# Altium schematic sheet STM32-ROMI_Rev_A_2_Connectors.SchDoc
size A4; Organization: Altium Limited; Address1: L3, 12a Rodborough Rd; Address2: Frenchs Forest; Address3: NSW; Address4: Australia 2086
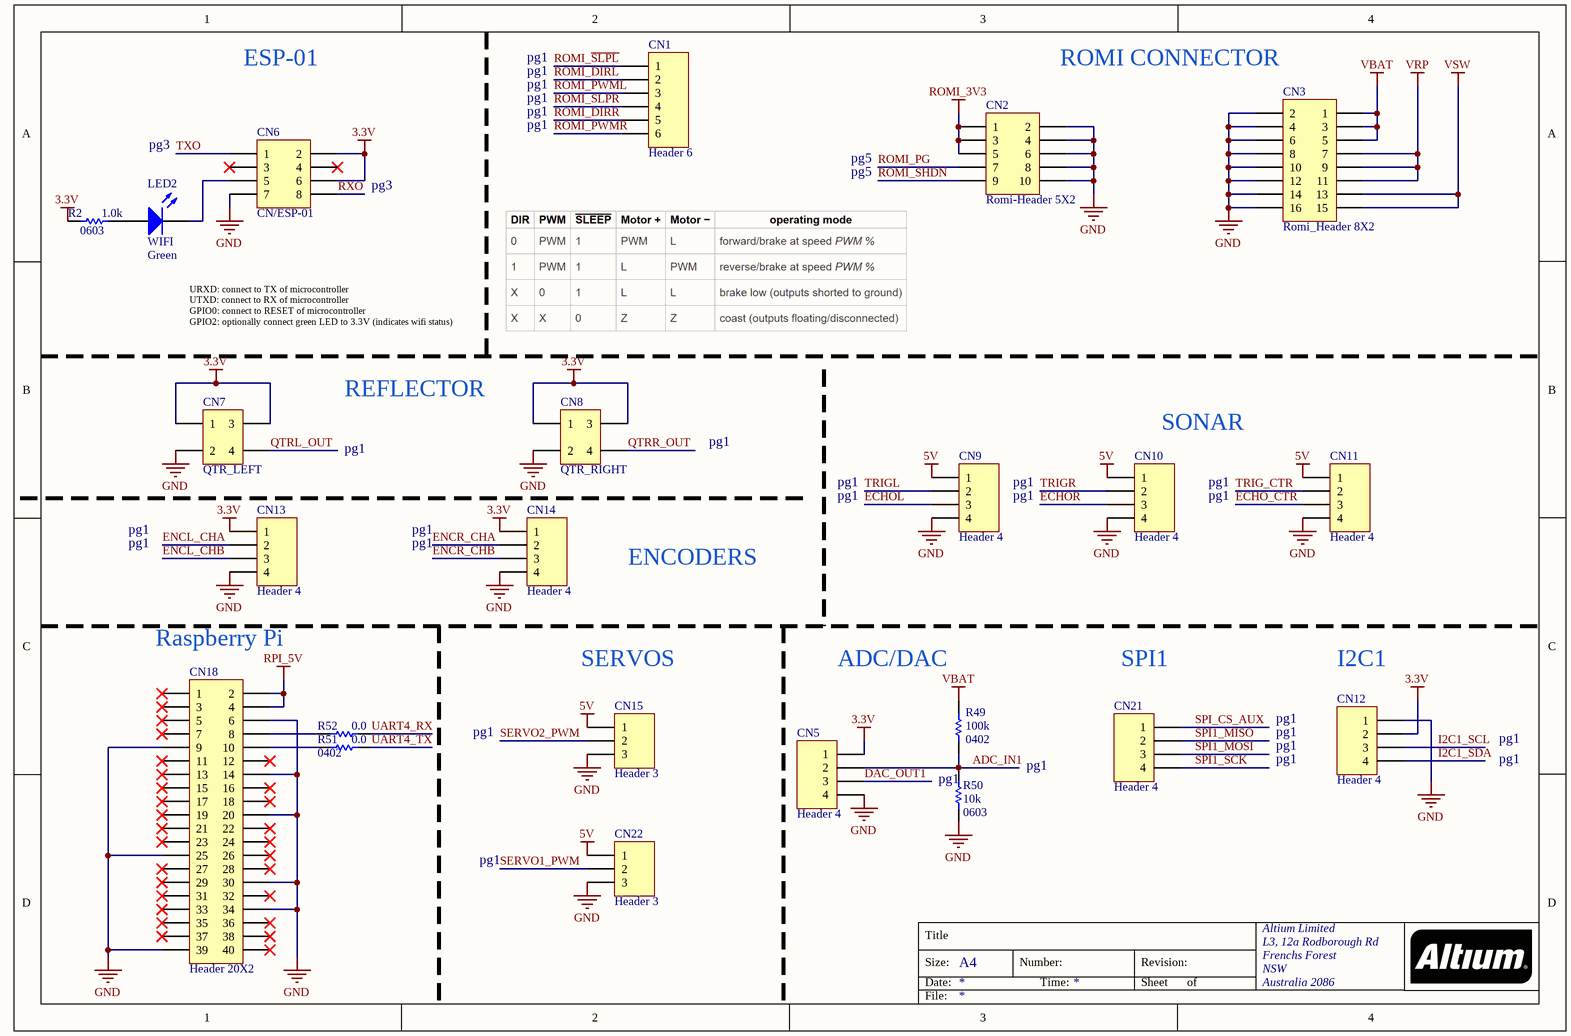
[diagram p0: STM32-ROMI_Rev_A_2_Connectors.SchDoc]

## Parts
CN1  Header 6  [PinHeader_1x06_P2.54mm_Vertical]
CN2  Romi-Header 5X2  [PinHeader_2x05_P2.54mm_Vertical - duplicate]
CN3  Romi_Header 8X2  [PinHeader_2x08_P2.54mm_Vertical]
CN5  Header 4  [HDR1X4]
CN6  CN/ESP-01  [ESP-01]
CN7  QTR_LEFT  [Molex 2x2 Microfit]
CN8  QTR_RIGHT  [Molex 2x2 Microfit]
CN9  Header 4  [HDR1X4]
CN10  Header 4  [HDR1X4]
CN11  Header 4  [HDR1X4]
CN12  Header 4  [HDR1X4]
CN13  Header 4  [HDR1X4]
CN14  Header 4  [HDR1X4]
CN15  Header 3  [HDR1X3]
CN18  Header 20X2  [Raspberry_Pi_2_3]
CN21  Header 4  [HDR1X4]
CN22  Header 3  [HDR1X3]
LED2  WIFI  Color: Green  [SM-LED-0603]
R2  Package / Case: 0603  [RESC0603(1608)_N]  (hidden comment: 1.0K)
R49  Supplier Device Package: 0402  Resistance (Ohms): 100k  [RESC0402(1005)_L]  (hidden comment: 100K 0402)
R50  Resistance (Ohms): 10k  Package / Case: 0603  [RESC0603(1608)_L]  (hidden comment: 10K 1%)
R51  Supplier Device Package: 0402  Resistance (Ohms): 0.0  [RESC0402(1005)_L]  (hidden comment: 0)
R52  Resistance (Ohms): 0.0  [RESC0402(1005)_L]  (hidden comment: 0)

## Nets
3.3V: CN5.1 CN6.2 CN6.6 CN7.1 CN7.3 CN8.1 CN8.3 CN12.2 CN13.1 CN14.1 R2.2
5V: CN9.1 CN10.1 CN11.1 CN15.1 CN22.1
GND: CN2.2 CN2.4 CN2.6 CN2.8 CN2.10 CN3.2 CN3.4 CN3.6 CN3.8 CN3.10 CN3.12 CN3.14 CN3.16 CN5.4 CN6.7 CN7.2 CN8.2 CN9.4 CN10.4 CN11.4 CN12.1 CN13.4 CN14.4 CN15.3 CN18.6 CN18.9 CN18.14 CN18.20 CN18.25 CN18.30 CN18.34 CN18.39 CN22.3 R50.1
ROMI_3V3: CN2.1 CN2.3 CN2.5
RPI_5V: CN18.2 CN18.4
VBAT: CN3.1 CN3.3 CN3.5 R49.2
VRP: CN3.7 CN3.9 CN3.11
VSW: CN3.13 CN3.15
ADC_IN1: CN5.2 R49.1 R50.2
DAC_OUT1: CN5.3
ECHO_CTR: CN11.3
ECHOL: CN9.3
ECHOR: CN10.3
ENCL_CHA: CN13.2
ENCL_CHB: CN13.3
ENCR_CHA: CN14.2
ENCR_CHB: CN14.3
I2C1_SCL: CN12.3
I2C1_SDA: CN12.4
QTRL_OUT: CN7.4
QTRR_OUT: CN8.4
ROMI_DIRL: CN1.2
ROMI_DIRR: CN1.5
ROMI_PG: CN2.7
ROMI_PWML: CN1.3
ROMI_PWMR: CN1.6
ROMI_~{SLPL}: CN1.1
ROMI_~{SLPR}: CN1.4
ROMI_SHDN: CN2.9
RXO: CN6.8
SERVO1_PWM: CN22.2
SERVO2_PWM: CN15.2
SPI1_MISO: CN21.2
SPI1_MOSI: CN21.3
SPI1_SCK: CN21.4
SPI_CS_AUX: CN21.1
TRIG_CTR: CN11.2
TRIGL: CN9.2
TRIGR: CN10.2
TXO: CN6.1
UART4_RX: R52.1
UART4_TX: R51.1
NetCN6_5: CN6.5 LED2.2
NetCN18_8: CN18.8 R52.2
NetCN18_10: CN18.10 R51.2
NetLED2_1: LED2.1 R2.1

Not connected (* = marked no-connect by the designer): CN6 3* 4*; CN18 1* 3* 5* 7* 11* 12* 13* 15* 16* 17* 18* 19* 21* 22* 23* 24* 26* 27* 28* 29* 31* 32* 33* 35* 36* 37* 38* 40*

## Notes on the sheet
- ESP-01
- pg1
- ROMI CONNECTOR
- pg3
- pg5
- URXD: connect to TX of microcontroller
  UTXD: connect to RX of microcontroller
  GPIO0: connect to RESET of microcontroller
  GPIO2: optionally connect green LED to 3.3V (indicates wifi status)
- REFLECTOR
- (near CN10) SONAR
- ENCODERS
- Raspberry Pi
- SERVOS
- ADC/DAC
- SPI1
- (near CN12) I2C1
- (near R50) pg1
- Title
- Size:
- Date:
- A4
- Number:
- Time:
- Revision:
- Sheet
- of
- File:

## Library data of the parts
CN1 = Romi_Header 6: Header, 6-Pin; Manufacturer: Sullins Connector Solutions; Manufacturer Part Number: PRPC006SAAN-RC; Connector Type: Header, Unshrouded, Breakaway; Number of Positions: 6; Number of Positions Loaded: All; Pitch: 0.100" (2.54mm); Supplier 1: Digi-Key; RoHS: RoHS Compliant; Category: Connectors, Interconnects; Stock 1: 1723; Pricing 1: 1=0.23, 10=0.205, 100=0.1689, 500=0.13352, 1000=0.11461, 5000=0.10456, 10000=0.10054 (USD); Packaging: Bulk; Contact Type: Male Pin; Number of Rows: 1; Row Spacing: -; Contact Mating Length: 0.230" (5.84mm); Mounting Type: Through Hole; Termination: Solder; Fastening Type: -; Features: -; Contact Finish: Gold; Contact Finish Thickness: Flash; Color: Black; ComponentLink1URL: http://media.digikey.com/PDF/Data%20Sheets/Sullins%20PDFs/xRxCzzzSxxN-RC_ST_11635-B.pdf; ComponentLink1Description: http://media.digikey.com/PDF/Data%20Sheets/Sullins%20PDFs/xRxCzzzSxxN-RC_ST_11635-B.pdf; Supplier Part Number 1: S1011EC-06-ND
CN2 = Romi-Header 5X2: Header, 5-Pin, Dual row; LatestRevisionDate: 17-Jul-2002; LatestRevisionNote: Re-released for DXP Platform.; Publisher: Altium Limited
CN3 = Romi_Header 8X2: Header, 8-Pin, Dual row; LatestRevisionDate: 17-Jul-2002; LatestRevisionNote: Re-released for DXP Platform.; Publisher: Altium Limited
CN5 CN9-CN14 CN21 = Header 4: Header, 4-Pin; Manufacturer: Sullins Connector Solutions; Manufacturer Part Number: PRPC004SAAN-RC; Connector Type: Header, Unshrouded, Breakaway; Number of Positions: 4; Number of Positions Loaded: All; Pitch: 0.100" (2.54mm); Supplier 1: Digi-Key; RoHS: RoHS Compliant; Category: Connectors, Interconnects; Stock 1: 0; Pricing 1: 1=0.2, 10=0.175, 100=0.1443, 500=0.1141, 1000=0.09794, 5000=0.08935, 10000=0.08591 (USD); Packaging: Bulk; Contact Type: Male Pin; Number of Rows: 1; Row Spacing: -; Contact Mating Length: 0.230" (5.84mm); Mounting Type: Through Hole; Termination: Solder; Fastening Type: -; Features: -; Contact Finish: Gold; Contact Finish Thickness: Flash; Color: Black; ComponentLink1URL: http://media.digikey.com/PDF/Data%20Sheets/Sullins%20PDFs/xRxCzzzSxxN-RC_ST_11635-B.pdf; ComponentLink1Description: http://media.digikey.com/PDF/Data%20Sheets/Sullins%20PDFs/xRxCzzzSxxN-RC_ST_11635-B.pdf; Supplier Part Number 1: S1011EC-04-ND
CN6 = CN/ESP-01: Header, 4-Pin, Dual row; LatestRevisionDate: 17-Jul-2002; LatestRevisionNote: Re-released for DXP Platform.; Publisher: Altium Limited
CN7 CN8 = MICROFIT 3.0 HDR VERT 4CKT: Molex Microfit 2x2 Vert Header; Manufacturer: Molex Inc; Manufacturer Part Number: 0430450427; Connector Type: Header, Shrouded; Number of Positions: 4; Number of Positions Loaded: All; Pitch: 0.118" (3.00mm); ClassName: *; Supplier 1: Digi-Key; RoHS: RoHS Compliant; Category: Connectors, Interconnects; Stock 1: 1962; Pricing 1: 1=1.28, 10=1.123, 50=1.0126, 100=0.9687, 250=0.8806, 500=0.79254, 1000=0.70448, 2500=0.63844, 5000=0.61642 (USD); Packaging: Tray; Contact Type: Male Pin; Number of Rows: 2; Row Spacing: 0.118" (3.00mm); Contact Mating Length: -; Mounting Type: Through Hole; Termination: Solder; Fastening Type: Locking Ramp; Features: Board Guide; Contact Finish: Tin; Contact Finish Thickness: 100µin (2.54µm); Color: Black; ComponentLink1URL: http://www.molex.com/pdm_docs/sd/430450427_sd.pdf; ComponentLink1Description: http://www.molex.com/pdm_docs/sd/430450427_sd.pdf; Supplier Part Number 1: WM10667-ND
CN15 CN22 = Header 3: Header, 3-Pin; Manufacturer: Sullins Connector Solutions; Manufacturer Part Number: PRPC003SAAN-RC; Connector Type: Header, Unshrouded, Breakaway; Number of Positions: 3; Number of Positions Loaded: All; Pitch: 0.100" (2.54mm); Supplier 1: Digi-Key; RoHS: RoHS Compliant; Category: Connectors, Interconnects; Stock 1: 0; Pricing 1: 1=0.18, 10=0.16, 100=0.132, 500=0.10438, 1000=0.0896, 5000=0.08174, 10000=0.0786 (USD); Packaging: Bulk; Contact Type: Male Pin; Number of Rows: 1; Row Spacing: -; Contact Mating Length: 0.230" (5.84mm); Mounting Type: Through Hole; Termination: Solder; Fastening Type: -; Features: -; Contact Finish: Gold; Contact Finish Thickness: Flash; Color: Black; ComponentLink1URL: http://media.digikey.com/PDF/Data%20Sheets/Sullins%20PDFs/xRxCzzzSxxN-RC_ST_11635-B.pdf; ComponentLink1Description: http://media.digikey.com/PDF/Data%20Sheets/Sullins%20PDFs/xRxCzzzSxxN-RC_ST_11635-B.pdf; Supplier Part Number 1: S1011EC-03-ND
CN18 = J/Header 20X2: Header, 20-Pin, Dual row; Manufacturer: Harwin Inc; Manufacturer Part Number: M20-9762046; Connector Type: Header, Unshrouded, Breakaway; Number of Positions: 40; Number of Positions Loaded: All; Pitch: 0.100" (2.54mm); Supplier 1: Digi-Key; RoHS: RoHS Compliant; Category: Connectors, Interconnects; Stock 1: 1666; Pricing 1: 1=1.08, 10=0.946, 25=0.8904, 50=0.8534, 100=0.8162, 250=0.742, 500=0.6678, 1000=0.5936, 2500=0.53795 (USD); Packaging: Bulk; Contact Type: Male Pin; Number of Rows: 2; Row Spacing: 0.100" (2.54mm); Contact Mating Length: 0.228" (5.80mm); Mounting Type: Through Hole; Termination: Solder; Fastening Type: -; Features: -; Contact Finish: Tin; Contact Finish Thickness: -; Color: Black; ComponentLink1URL: http://www.harwin.com/include/downloads/drawings/M20-976.PDF; ComponentLink1Description: http://www.harwin.com/include/downloads/drawings/M20-976.PDF; Supplier Part Number 1: 952-1896-ND
LED2 = LTST-C191KGKT: LED GREEN CLEAR THIN 0603 SMD; Manufacturer: Lite-On Inc; Wavelength - Dominant: 571nm; Wavelength - Peak: 574nm; Millicandela Rating: 35mcd; Voltage - Forward (Vf) (Typ): 2V; Current - Test: 20mA; Viewing Angle: 130°; Lens Style/Size: Rectangle with Flat Top, 1.1mm x 0.8mm; Supplier 1: Digi-Key; Manufacturer Part Number: LTST-C191KGKT; RoHS: RoHS Compliant; Category: Optoelectronics; Stock 1: 84829; Pricing 1: 1=0.3, 10=0.238, 100=0.1296, 250=0.0864, 500=0.07344, 1000=0.05616, 2500=0.05076 (USD); Packaging: Cut Tape (CT); Lens Type: Clear; Package / Case: 0603 (1608 Metric); Size / Dimension: 1.60mm L x 0.80mm W; Height: 0.55mm; Mounting Type: Surface Mount; Luminous Flux @ Current - Test: -; ComponentLink1URL: http://optoelectronics.liteon.com/upload/download/DS22-2000-228/S_110_LTST-C191KGKT.pdf; ComponentLink1Description: http://optoelectronics.liteon.com/upload/download/DS22-2000-228/S_110_LTST-C191KGKT.pdf; Supplier Part Number 1: 160-1446-1-ND; ClassName: *
R2 = RES 1K OHM 1% 1/10W 0603: 1.0K 0603; Manufacturer: Stackpole Electronics Inc.; Manufacturer Part Number: RMCF0603FT1K00; Tolerance: ±1%; Power (Watts): 0.1W, 1/10W; Temperature Coefficient: ±100ppm/°C; Supplier 1: Digi-Key; RoHS: RoHS Compliant; Category: Resistors; Stock 1: 411308; Pricing 1: 1=0.1, 10=0.02, 100=0.0081, 1000=0.00364, 2500=0.00316 (USD); Packaging: Cut Tape (CT); Part Status: Active; Composition: Thick Film; Features: Automotive AEC-Q200; Operating Temperature: -55°C ~ 155°C; Size / Dimension: 0.061" L x 0.031" W (1.55mm x 0.80mm); Height - Seated (Max): 0.022" (0.55mm); Failure Rate: -; ComponentLink1URL: https://www.seielect.com/Catalog/SEI-RMCF_RMCP.pdf; ComponentLink1Description: https://www.seielect.com/Catalog/SEI-RMCF_RMCP.pdf; Supplier Part Number 1: RMCF0603FT1K00CT-ND; Supplier Device Package: 0603; Resistance (Ohms): 1.0k
R49 = RES 100K OHM 1% 1/16W 0402: Manufacturer: Yageo; Manufacturer Part Number: RC0402FR-07100KL; Power (Watts): 0.1W, 1/10W; Temperature Coefficient: ±100ppm/°C; Tolerance: ±1%; RoHS: RoHS Compliant; Category: Resistors; Stock 1: 3706939; Pricing 1: 1=0.1, 50=0.0196, 100=0.0149, 250=0.01104, 500=0.00816, 1000=0.00544, 5000=0.00383 (USD); Packaging: Cut Tape (CT); Composition: Thick Film; Features: Automotive AEC-Q200; Operating Temperature: -55°C ~ 155°C; Package / Case: 0402 (1005 Metric); Size / Dimension: 0.039" L x 0.020" W (1.00mm x 0.50mm); Height: 0.016" (0.40mm); Number of Terminations: 2; ComponentLink1URL: http://industrial.panasonic.com/www-cgi/jvcr13pz.cgi?E+PZ+3+AOA0002+ERJ2RKF1003X+7+WW; ComponentLink1Description: http://industrial.panasonic.com/www-cgi/jvcr13pz.cgi?E+PZ+3+AOA0002+ERJ2RKF1003X+7+WW; Supplier 1: Digi-Key; Supplier 2: Digi-Key; Supplier Part Number 1: 311-100KLRCT-ND; Supplier Part Number 2: RMCF0402FT100KCT-ND
R50 = RES 10K OHM 1/10W 1% 0603 SMD: 10K 0603; Manufacturer: Panasonic Electronic Components; Manufacturer Part Number: ERJ-3EKF1002V; Power (Watts): 0.1W, 1/10W; Temperature Coefficient: ±100ppm/°C; Category: Resistors; Supplier 1: Digi-Key; RoHS: RoHS Compliant; Stock 1: 5046430; Pricing 1: 1=0.1, 50=0.015, 100=0.0114, 250=0.00844, 500=0.00624, 1000=0.00416, 2500=0.00351 (USD); Packaging: Cut Tape (CT); Tolerance: ±1%; Composition: Thick Film; Features: -; Supplier Device Package: 0603; Size / Dimension: 0.063" L x 0.031" W (1.60mm x 0.80mm); Height: 0.022" (0.55mm); Number of Terminations: 2; ComponentLink1URL: http://industrial.panasonic.com/www-cgi/jvcr13pz.cgi?E+PZ+3+AOA0002+ERJ3EKF1002V+7+WW; ComponentLink1Description: http://industrial.panasonic.com/www-cgi/jvcr13pz.cgi?E+PZ+3+AOA0002+ERJ3EKF1002V+7+WW; Supplier Part Number 1: P10.0KHCT-ND
R51 R52 = RES 0.0 OHM JUMPER 1/10W 0402: 0.0 0402; Manufacturer: Panasonic Electronic Components; Manufacturer Part Number: ERJ-2GE0R00X; Tolerance: Jumper; Power (Watts): 0.1W, 1/10W; Supplier 1: Digi-Key; RoHS: RoHS Compliant; Category: Resistors; Stock 1: 8429476; Pricing 1: 1=0.1, 50=0.0138, 100=0.0105, 250=0.0078, 500=0.00576, 1000=0.00384, 5000=0.0027 (USD); Packaging: Cut Tape (CT); Composition: Thick Film; Features: Automotive AEC-Q200; Temperature Coefficient: -; Operating Temperature: -55°C ~ 155°C; Package / Case: 0402 (1005 Metric); Size / Dimension: 0.039" L x 0.020" W (1.00mm x 0.50mm); Height: 0.016" (0.40mm); Number of Terminations: 2; ComponentLink1URL: http://industrial.panasonic.com/www-cgi/jvcr13pz.cgi?E+PZ+3+AOA0001+ERJ2GE0R00X+7+WW; ComponentLink1Description: http://industrial.panasonic.com/www-cgi/jvcr13pz.cgi?E+PZ+3+AOA0001+ERJ2GE0R00X+7+WW; Supplier Part Number 1: P0.0JCT-ND; Creator: osman
  R52: Supplier Device Package: 0402